# EAGLE design midipal-v03 (EAGLE 5.09)
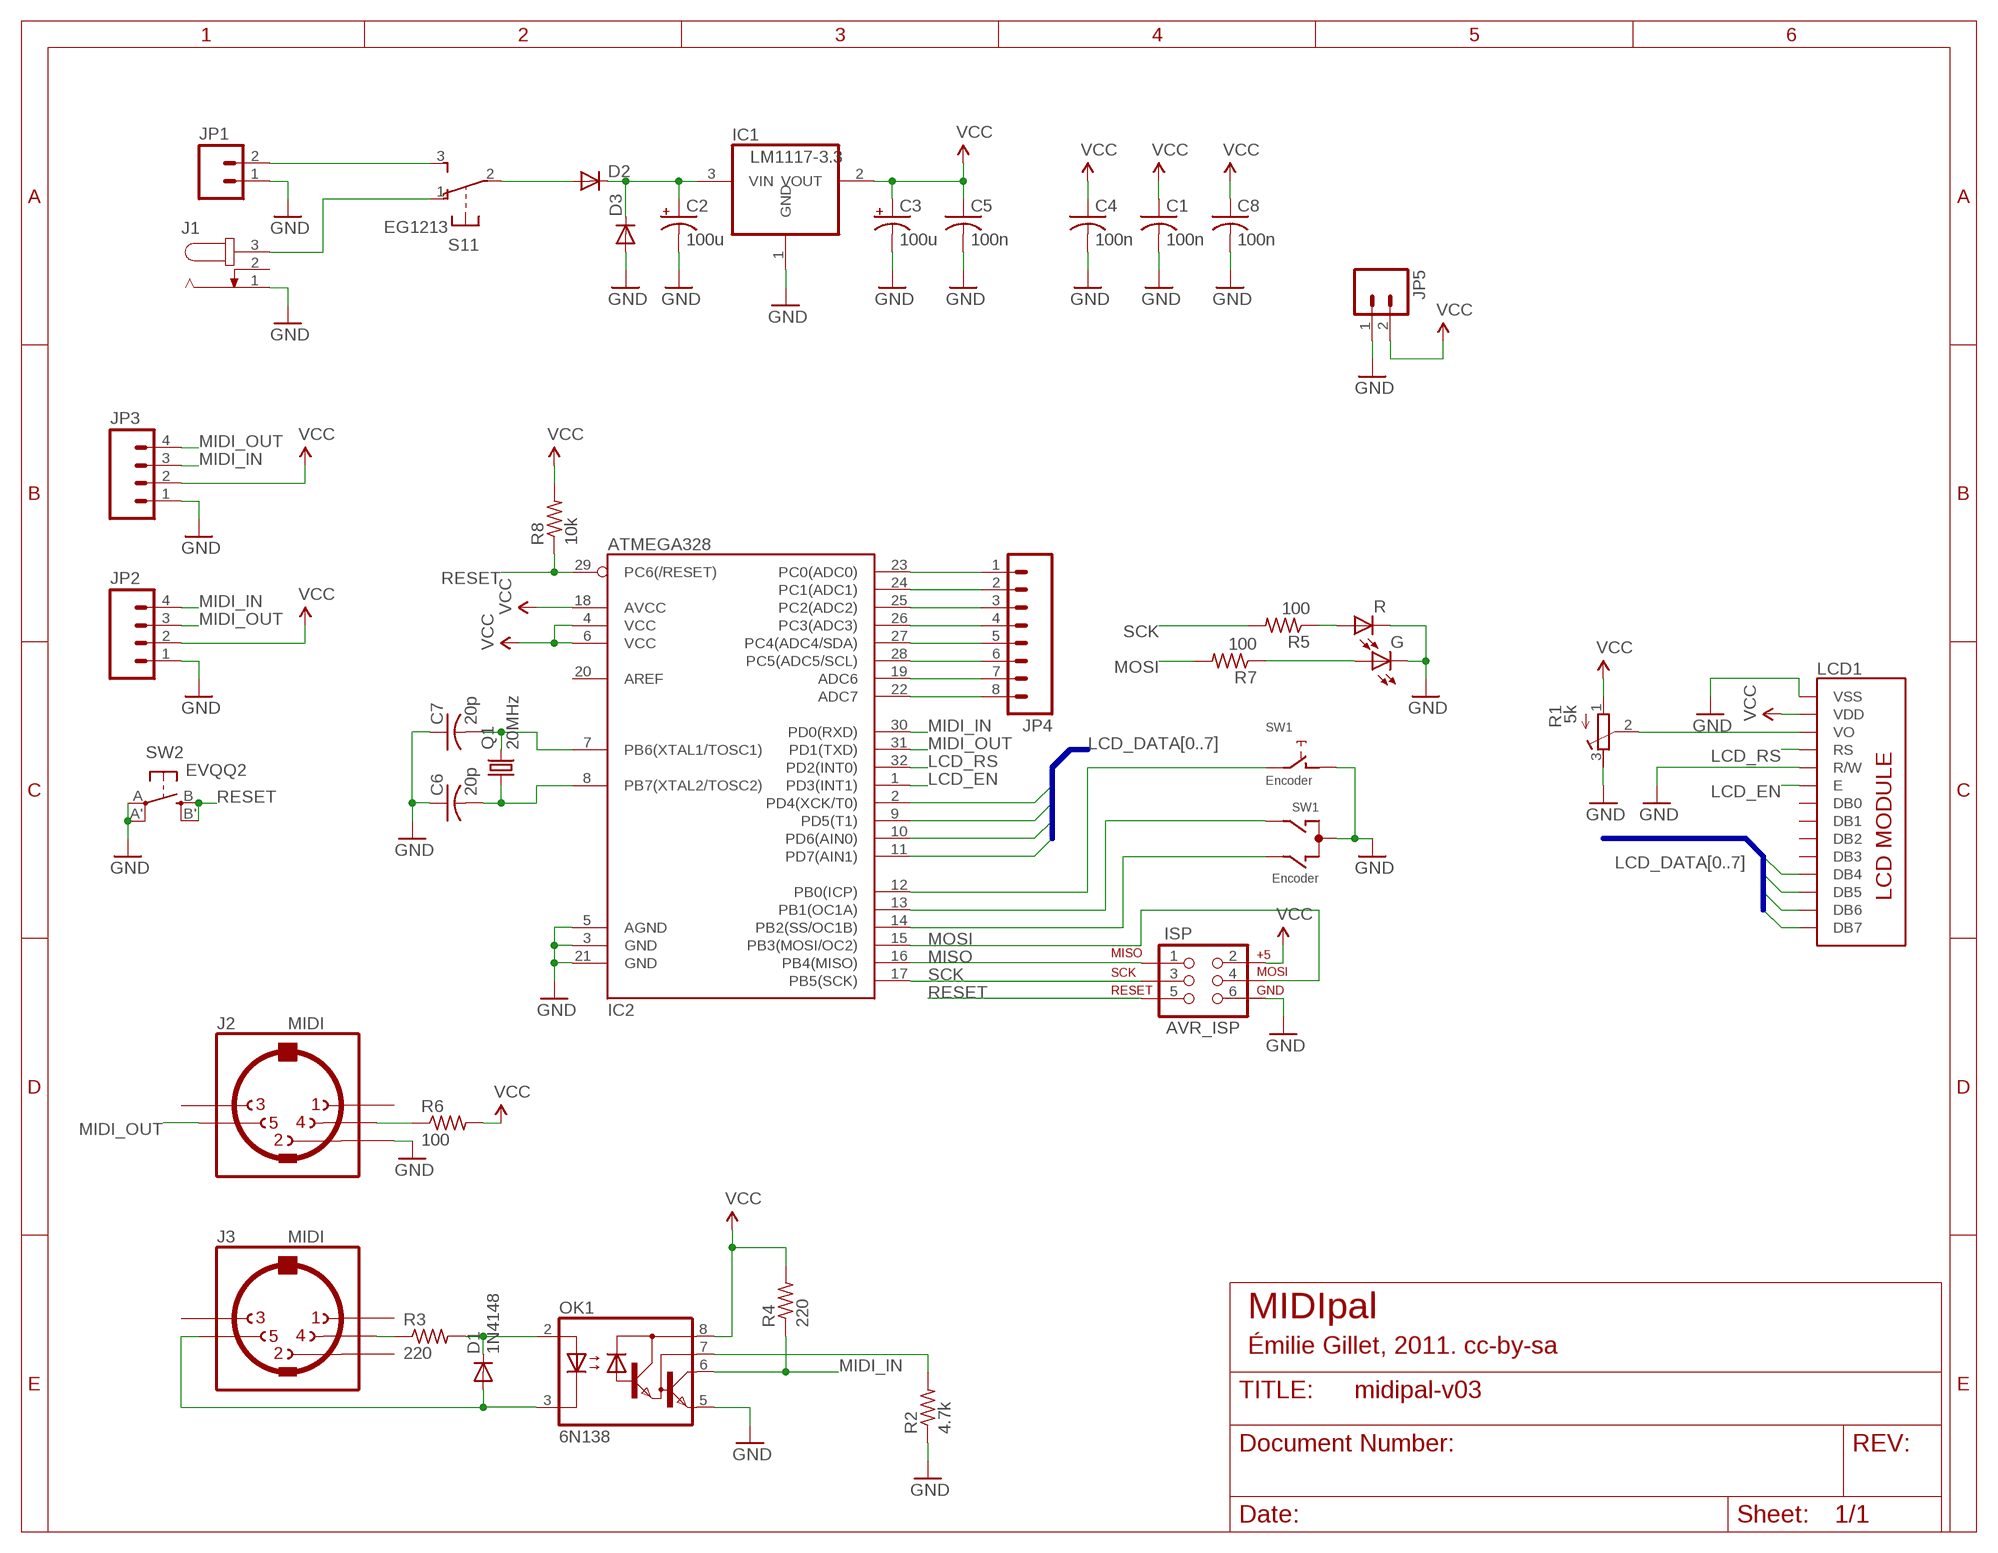
[diagram p0: schematic, sheet 1]

## Parts
C1  100n  C-USC0805  [C0805]
C2  100u  CPOL-USD  [PANASONIC_D]
C3  100u  CPOL-USD  [PANASONIC_D]
C4  100n  C-USC0805  [C0805]
C5  100n  C-USC0805  [C0805]
C6  20p  C-USC0805  [C0805]
C7  20p  C-USC0805  [C0805]
C8  100n  C-USC0805  [C0805]
D1  1N4148  DIODE-SOD323-W  [SOD323-W]
D2  DIODESMB  [SMB-DIODE]
D3  DIODESMB  [SMB-DIODE]
G  LEDCHIPLED_1206  [CHIPLED_1206]
IC1  LM1117-3.3  REG1117  [SOT223]
IC2  ATMEGA328  ATMEGA168  [TQFP32-08]
ISP  AVR_ISP  AVR_SPI_PRG_6PTH  [2X3]
J1  JACK-PLUG2  [SPC4078_BIG_HOLES]
J2  MIDI  MAB5SH  [MAB5SH]
J3  MIDI  MAB5SH  [MAB5SH]
JP1  M02  [1X02_LONGPADS]
JP2  M04PTH  [1X04]
JP3  M04PTH  [1X04]
JP4  M08  [1X08]
JP5  M02PTH  [1X02]
LCD1  LCD_MODULE_NO_BKL  [LCD_MODULE_1X8]
OK1  6N138  6N138SMD8  [DIL8-SMD]
Q1  20MHz  CRYSTALHC49UP  [HC49UP]
R  LEDCHIPLED_1206  [CHIPLED_1206]
R1  5k  R-TRIMM3296P  [RTRIM3296P]
R2  4.7k  R-US_M0805  [M0805]
R3  220  R-US_M0805  [M0805]
R4  220  R-US_R0805  [R0805]
R5  100  R-US_R0805  [R0805]
R6  100  R-US_R0805  [R0805]
R7  100  R-US_R0805  [R0805]
R8  10k  R-US_R0805  [R0805]
S1  EG1213  [EG1213]
SW1  Encoder  EC12E_SW  [ALPS_EC12E_SW]
SW2  EVQQ2  [EVQ-Q2]

## Nets
GND: C1.2 C2.- C3.- C4.2 C5.2 C6.1 C7.1 C8.2 D3.A G.C IC1.1(GND) IC2.3(GND) IC2.5(AGND) IC2.21(GND) ISP.6 J1.1 J2.2 JP1.1 JP2.1 JP3.1 JP5.1 LCD1.1(VSS) LCD1.5(R/W) OK1.5(GND) R1.3(A) R2.1 R.C SW1.C SW1.D SW2.A'(P1) SW2.A(P)
LCD_DATA4: IC2.2(PD4(XCK/T0)) LCD1.11(DB4)
LCD_DATA5: IC2.9(PD5(T1)) LCD1.12(DB5)
LCD_DATA6: IC2.10(PD6(AIN0)) LCD1.13(DB6)
LCD_DATA7: IC2.11(PD7(AIN1)) LCD1.14(DB7)
LCD_EN: IC2.1(PD3(INT1)) LCD1.6(E)
LCD_RS: IC2.32(PD2(INT0)) LCD1.4(RS)
MIDI_IN: IC2.30(PD0(RXD)) JP2.4 JP3.3 OK1.6(VO) R4.1
MIDI_OUT: IC2.31(PD1(TXD)) J2.5 JP2.3 JP3.4
MISO: IC2.16(PB4(MISO)) ISP.1
MOSI: IC2.15(PB3(MOSI/OC2)) ISP.4 R7.2
N$1: J1.3 S1.1(1:O)
N$2: C2.+ D2.C D3.C IC1.3(VIN)
N$3: IC2.23(PC0(ADC0)) JP4.1
N$4: D2.A S1.2(1:P)
N$5: IC2.24(PC1(ADC1)) JP4.2
N$6: IC2.25(PC2(ADC2)) JP4.3
N$7: IC2.26(PC3(ADC3)) JP4.4
N$8: IC2.27(PC4(ADC4/SDA)) JP4.5
N$9: IC2.28(PC5(ADC5/SCL)) JP4.6
N$10: IC2.19(ADC6) JP4.7
N$11: IC2.22(ADC7) JP4.8
N$12: G.A R7.1
N$13: OK1.7(VB) R2.2
N$14: R5.1 R.A
N$15: IC2.14(PB2(SS/OC1B)) SW1.B
N$16: IC2.13(PB1(OC1A)) SW1.A
N$17: IC2.12(PB0(ICP)) SW1.E
N$18: LCD1.3(VO) R1.2(S)
N$28: D1.C OK1.2(A) R3.2
N$68: J2.4 R6.1
N$72: J3.4 R3.1
N$73: D1.A J3.5 OK1.3(C)
N$82: C6.2 IC2.8(PB7(XTAL2/TOSC2)) Q1.1
N$83: C7.2 IC2.7(PB6(XTAL1/TOSC1)) Q1.2
RESET: IC2.29(PC6(/RESET)) ISP.5 R8.1 SW2.B'(S1) SW2.B(S)
SCK: IC2.17(PB5(SCK)) ISP.3 R5.2
VCC: C1.1 C3.+ C4.1 C5.1 C8.1 IC1.2(VOUT) IC2.4(VCC) IC2.6(VCC) IC2.18(AVCC) ISP.2 JP2.2 JP3.2 JP5.2 LCD1.2(VDD) OK1.8(VCC) R1.1(E) R4.2 R6.2 R8.2
VIN: JP1.2 S1.3(1:S)
Unconnected: IC2.20(AREF) J1.2 J2.1 J2.3 J3.1 J3.2 J3.3 LCD1.7(DB0) LCD1.8(DB1) LCD1.9(DB2) LCD1.10(DB3) S1.MT1(MT) S1.MT2(MT) SW1.GND1(G) SW1.GND2(G)

## Buses
LCD_DATA[0..7]

## Notes on the sheet
- MIDIpal
- Émilie Gillet, 2011. cc-by-sa

## Library data of the parts
C1 C4-C8 = rcl:C-US: CAPACITOR, American symbol
C2 C3 = rcl:CPOL-US: POLARIZED CAPACITOR, American symbol
D1 = diode:DIODE-: DIODE
D2 D3 = SparkFun:DIODE: Diode These are standard reverse protection diodes and small signal diodes. SMA package can handle up to about 1A. SOD-323 can handle about 200mA. What the SOD-323 package when ordering, there are some mfgs out there that are 5-pin packages.
G R = led:LED: LED OSRAM: - CHIPLED LG R971, LG N971, LY N971, LG Q971, LY Q971, LO R971, LY R971 LH N974, LH R974 LS Q976, LO Q976, LY Q976 LO Q996 - Hyper CHIPLED LW Q18S LB Q993, LB Q99A, LB R99A - SideLED LS A670, LO A670, LY A670, LG A670, LP A670 LB A673, LV A673, LT A673, LW A673 LH A674 LY A675 LS A676, LA A676, LO A676, LY A676, LW A676 LS A679, LY A679, LG A679 - Hyper Micro SIDELED® LS Y876, LA Y876, LO Y876, LY Y876 LT Y87S - SmartLED LW L88C, LW L88S LB L89C, LB L89S, LG L890 LS L89K, LO L89K, LY L89K LS L896, LA L896, LO L896, LY L896 - TOPLED LS T670, LO T670, LY T670, LG T670, LP T670 LSG T670, LSP T670, LSY T670, LOP T670, LYG T670 LG T671, LOG T671, LSG T671 LB T673, LV T673, LT T673, LW T673 LH T674 LS T676, LA T676, LO T676, LY T676, LB T676, LH T676, LSB T676, LW T676 LB T67C, LV T67C, LT T67C, LS T67K, LO T67K, LY T67K, LW E67C LS E67B, LA E67B, LO E67B, LY E67B, LB E67C, LV E67C, LT E67C LW T67C LS T679, LY T679, LG T679 LS T770, LO T770, LY T770, LG T770, LP T770 LB T773, LV T773, LT T773, LW T773 LH T774 LS E675, LA E675, LY E675, LS T675 LS T776, LA T776, LO T776, LY T776, LB T776 LHGB T686 LT T68C, LB T68C - Hyper Mini TOPLED® LB M676 - Mini TOPLED Santana® LG M470 LS M47K, LO M47K, LY M47K Source: http://www.osram.convergy.de LUXEON: - LUMILED® LXK2-PW12-R00, LXK2-PW12-S00, LXK2-PW14-U00, LXK2-PW14-V00 LXK2-PM12-R00, LXK2-PM12-S00, LXK2-PM14-U00 LXK2-PE12-Q00, LXK2-PE12-R00, LXK2-PE12-S00, LXK2-PE14-T00, LXK2-PE14-U00 LXK2-PB12-K00, LXK2-PB12-L00, LXK2-PB12-M00, LXK2-PB14-N00, LXK2-PB14-P00, LXK2-PB14-Q00 LXK2-PR12-L00, LXK2-PR12-M00, LXK2-PR14-Q00, LXK2-PR14-R00 LXK2-PD12-Q00, LXK2-PD12-R00, LXK2-PD12-S00 LXK2-PH12-R00, LXK2-PH12-S00 LXK2-PL12-P00, LXK2-PL12-Q00, LXK2-PL12-R00 Source: www.luxeon.com KINGBRIGHT: KA-3528ASYC Source: www.kingbright.com
IC1 = burr-brown:REG1117: 800mA and 1A Low Dropout (LDO) Positive Regulator 1.8V, 2.5V, 2.85V, 3.3V, 5V, and Adj
IC2 = SparkFun:ATMEGA168
ISP = SparkFun:AVR_SPI_PRG_6: AVR ISP 6 Pin This is the reduced ISP connector for AVR programming. Common on Arduino. This footprint will take up less PCB space and can be used with a 10-pin to 6-pin adapter such as SKU: BOB-08508
J1 = con-jack2:JACK-PLUG: DC POWER JACK Power Jack, DC, Right Angle, Through Hole, Rated 5A at 16VDC, PC Terminals Distributor: Farnell (www.Farnell.de) Drawing: 84N1161.pdf / 84N1162.pdf Manufacturer: SPC Technology (www.spctechnology.com) Type: SPC4077 / SPC 4078
J2 J3 = og-midi:MAB5SH: Female CONNECTOR 5 pins 90 deg. with shield, horizontal (DIN 41524)
JP1 JP5 = SparkFun:M02: Header 2 Standard 2-pin 0.1" header. Use with straight break away headers (SKU : PRT-00116), right angle break away headers (PRT-00553), swiss pins (PRT-00743), machine pins (PRT-00117), and female headers (PRT-00115). Molex polarized connector foot print use with SKU : PRT-08233 with associated crimp pins and housings.
JP2 JP3 = SparkFun:M04: Header 4 Standard 4-pin 0.1" header. Use with straight break away headers (SKU : PRT-00116), right angle break away headers (PRT-00553), swiss pins (PRT-00743), machine pins (PRT-00117), and female headers (PRT-00115). Molex polarized connector foot print use with SKU : PRT-08231 with associated crimp pins and housings.
JP4 = SparkFun:M08: Header 8 Standard 8-pin 0.1" header. Use with straight break away headers (SKU : PRT-00116), right angle break away headers (PRT-00553), swiss pins (PRT-00743), machine pins (PRT-00117), and female headers (PRT-00115).
LCD1 = og-lcd:LCD_MODULE_NO_BKL
OK1 = og-optocouplers:6N138: MOTOROLA OPTO COUPLER
Q1 = crystal:CRYSTAL: CRYSTAL
R1 = rcl:R-TRIMM: Trimm resistor
R2-R8 = rcl:R-US_: RESISTOR, American symbol
S1 = adafruit:EG1213: E-Switch right-angle slide SPDT Part #EG1213 http://www.ladyada.net/library/eagle
SW1 = switch-alps:EC12E_SW: ALPS rotary Encoder EC12E series with switch
SW2 = adafruit:EVQQ2: SMT 6mm switch, EVQQ2 series http://www.ladyada.net/library/eagle

## Board
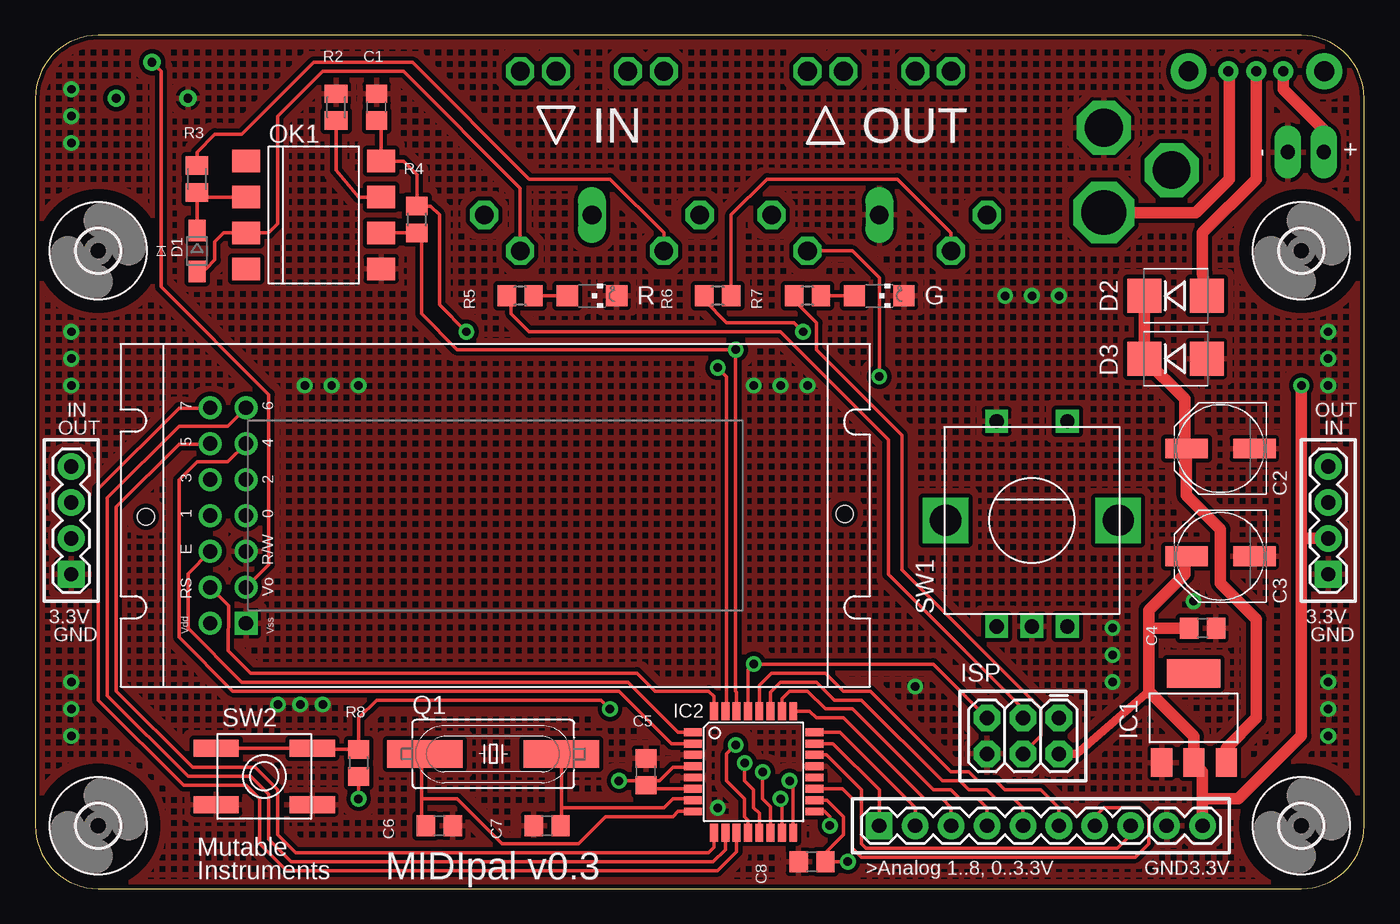
[diagram p1: board, top side]
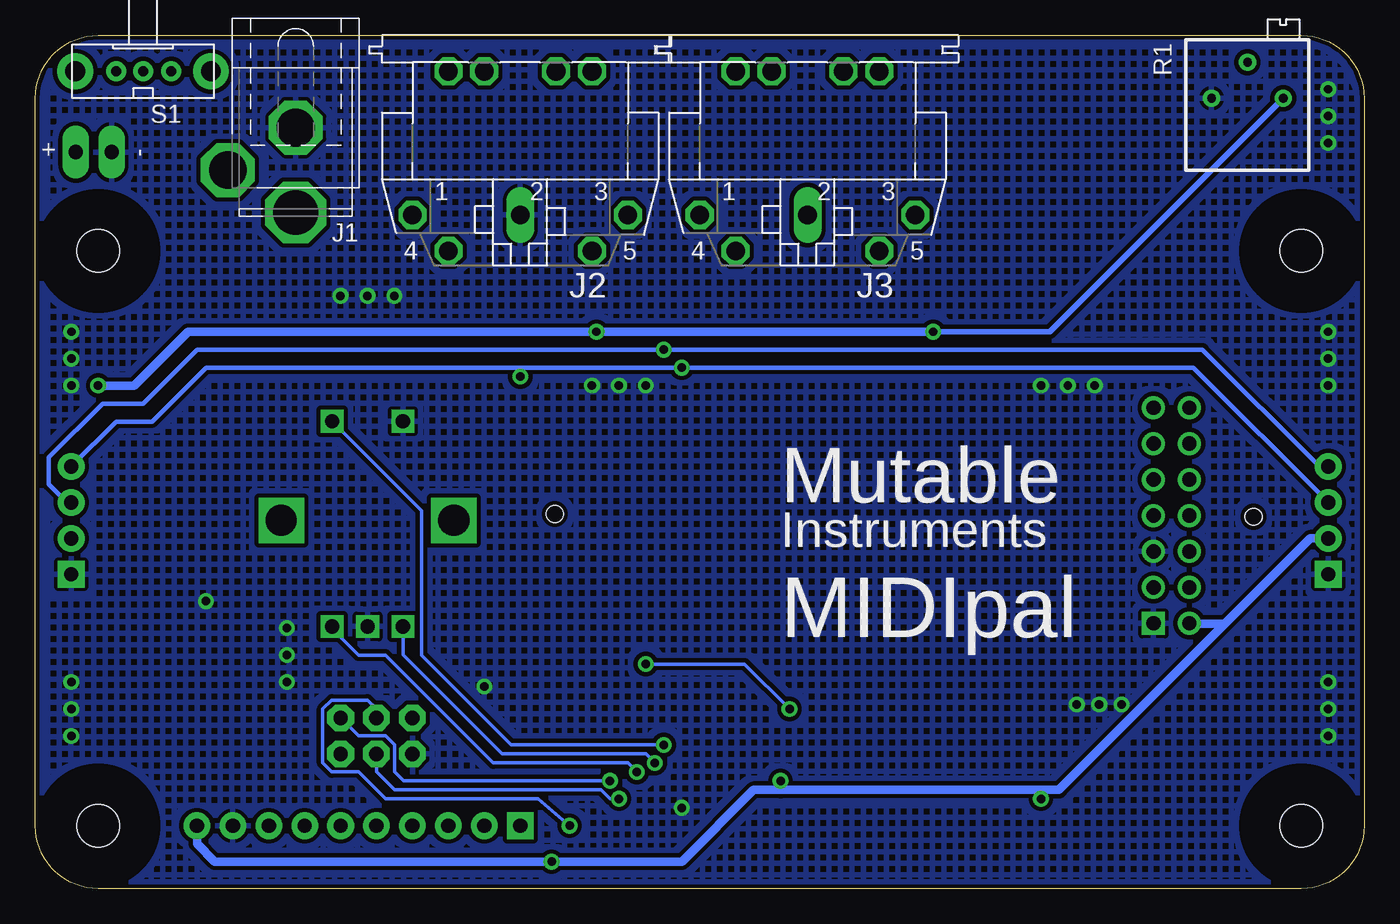
[diagram p2: board, bottom side, seen from below]

Size 93.98 x 60.33 mm. Coordinates in mm from the lower left corner, seen from the top.
Outline: 4.45,60.33 arc90 0,55.88 0,4.45 arc90 4.45,0 89.53,0 arc90 93.98,4.45 93.98,55.88 arc90 89.53,60.33 4.45,60.33
Copper layers (1*16): Top 0.035mm / dielectric 1.5mm / Bottom 0.035mm
Design rules "SparkFun": minimum track width 8mil, minimum drill 20mil, track to track 8mil, track to pad 8mil, pad to pad 8mil, via to via 8mil, smd to smd 8mil, copper to edge 10mil, drill to drill 8mil, minimum pad ring 12mil, minimum via ring 10mil, stop-mask expansion 4mil, vias tented up to drill 25mil, thermal gap 10mil

### Footprints (pad centres in the part's own frame; a part is rotated, then mirrored left to right if it is on the bottom)
C0805 = smd 1.3 x 1.5: 1 -0.95,0; 2 0.95,0
PANASONIC_D = smd 3 x 1.4: + 2.4,0; - -2.4,0
SOD323-W = smd 1.5 x 1.2: A 1.45,0; C -1.45,0
SMB-DIODE = smd 2.4 x 2.4: A 2.2,0; C -2.2,0
CHIPLED_1206 = smd 1.5 x 1.5: A 0,-1.75; C 0,1.75
SOT223 = smd 1.499 x 2.007: 1 -2.261,-3.15; 2 0.025,-3.15; 3 2.311,-3.15 | smd 3.81 x 2.007: 4 0,3.15
TQFP32-08 = smd 1.27 x 0.559: 1 -4.293,2.8; 2 -4.293,2; 3 -4.293,1.2; 4 -4.293,0.4; 5 -4.293,-0.4; 6 -4.293,-1.2; 7 -4.293,-2; 8 -4.293,-2.8; 17 4.293,-2.8; 18 4.293,-2; 19 4.293,-1.2; 20 4.293,-0.4; 21 4.293,0.4; 22 4.293,1.2; 23 4.293,2; 24 4.293,2.8 | smd 0.559 x 1.27: 9 -2.8,-4.293; 10 -2,-4.293; 11 -1.2,-4.293; 12 -0.4,-4.293; 13 0.4,-4.293; 14 1.2,-4.293; 15 2,-4.293; 16 2.8,-4.293; 25 2.8,4.293; 26 2,4.293; 27 1.2,4.293; 28 0.4,4.293; 29 -0.4,4.293; 30 -1.2,4.293; 31 -2,4.293; 32 -2.8,4.293
2X3 = drill 1.016 pad 1.88 octagon: 1 0,0; 2 0,2.54; 3 2.54,0; 4 2.54,2.54; 5 5.08,0; 6 5.08,2.54
SPC4078_BIG_HOLES = drill 2.667 pad 3.81 octagon: 1 -0.46,0; 2 2.54,-4.8 | drill 3.175 pad 4.318 octagon: 3 5.54,0
MAB5SH = drill 1.321 octagon: 1 7.62,7.62; 3 -7.62,7.62; 4 5.08,10.16; 5 -5.08,10.16; P$1 -5.08,-2.54; P$2 -2.54,-2.54; P$3 2.54,-2.54; P$4 5.08,-2.54 | drill 1.321 long: 2 0,7.62
1X02_LONGPADS = drill 1.016 pad 1.88 long: 1 0,0; 2 2.54,0
1X04 = drill 1.016 pad 1.88 square: 1 0,0 | drill 1.016 pad 1.88 round: 2 2.54,0; 3 5.08,0; 4 7.62,0
1X08 = drill 1.016 pad 1.88 square: 1 0,0 | drill 1.016 pad 1.88 round: 2 2.54,0; 3 5.08,0; 4 7.62,0; 5 10.16,0; 6 12.7,0; 7 15.24,0; 8 17.78,0
1X02 = drill 1.016 pad 1.88 round: 1 0,0; 2 2.54,0
LCD_MODULE_1X8 = drill 1.016 square: 1 8.87,4.47 | drill 1.016 round: 2 6.33,4.47; 3 8.87,7.01; 4 6.33,7.01; 5 8.87,9.55; 6 6.33,9.55; 7 8.87,12.09; 8 6.33,12.09; 9 8.87,14.63; 10 6.33,14.63; 11 8.87,17.17; 12 6.33,17.17; 13 8.87,19.71; 14 6.33,19.71 | hole 1.2: 1.8,12; 51.2,12.2
DIL8-SMD = smd 1.6 x 2: 1 -3.81,-4.77; 2 -1.27,-4.77; 3 1.27,-4.77; 4 3.81,-4.77; 5 3.81,4.77; 6 1.27,4.77; 7 -1.27,4.77; 8 -3.81,4.77
HC49UP = smd 5.334 x 1.93: 1 -4.826,0; 2 4.826,0
RTRIM3296P = drill 0.61 round: 1 0,-2.54; 2 2.54,0; 3 0,2.54
M0805 = smd 1.3 x 1.6: 1 -0.95,0; 2 0.95,0
R0805 = smd 1.3 x 1.5: 1 -0.95,0; 2 0.95,0
EG1213 = drill 0.7 pad 1.422 round: 1 -2,0; 2 0,0; 3 1.9,0 | drill 1.4 pad 2.54 round: MT1 -4.8,0; MT2 4.8,0
ALPS_EC12E_SW = drill 1 square: A -2.5,-7.5; B 2.5,-7.5; C 0,-7.5; D -2.5,7; E 2.5,7 | drill 2.2 square: GND1 -6.1,0; GND2 6.1,0
EVQ-Q2 = smd 3.2 x 1.2: A -3.4,-2; A' 3.4,-2; B -3.4,2; B' 3.4,2
3,0 = hole 3: 0,0

### Placement (x,y rotation side)
C1  24.13,55.25 90 top
C2  83.82,31.11 180 top
C3  83.82,23.49 180 top
C4  82.55,18.41 0 top
C5  43.18,8.26 90 top
C6  28.57,4.45 180 top
C7  36.2,4.45 0 top
C8  54.93,1.91 180 top
D1  11.43,45.09 270 top
D2  80.64,41.91 0 top
D3  80.64,37.47 0 top
G  59.69,41.91 270 top
IC1  81.91,12.06 0 top
IC2  50.8,8.26 0 top
ISP  72.39,12.06 180 top
J1  75.56,53.34 270 bottom
J2  59.69,55.25 180 bottom
J3  39.37,55.25 180 bottom
JP1  88.58,52.07 0 top
JP2  2.54,22.22 90 top
JP3  91.44,22.22 90 top
JP4  59.69,4.45 0 top
JP5  80.01,4.45 0 top
LCD1  6.03,14.29 0 top
OK1  19.68,47.62 270 top
Q1  32.38,9.53 0 top
R  39.37,41.91 270 top
R1  8.26,55.88 90 bottom
R2  21.27,55.25 270 top
R3  11.43,50.16 270 top
R4  26.99,47.31 90 top
R5  34.29,41.91 180 top
R6  48.26,41.91 180 top
R7  54.61,41.91 180 top
R8  22.86,8.89 270 top
S1  86.36,57.79 180 bottom
SW1  70.48,26.04 0 top
SW2  16.19,7.94 0 top
U$1  [3,0]  4.45,45.09 0 top
U$2  [3,0]  89.53,45.09 0 top
U$3  [SARASWATI]  57.15,17.78 0 bottom
U$4  [3,0]  4.45,4.45 0 top
U$5  [3,0]  89.53,4.45 0 top

### Tracks (layer width: path | path; a pad name or v marks a point on that pad's centre or on a via)
GND  (via drill 0.6)
  other vias: 81.91,20.32 48.26,5.71 62.23,14.29 76.2,18.41 76.2,16.51 76.2,14.61 17.14,13.02 18.73,13.02 20.32,13.02 50.8,35.56 2.54,56.52 2.54,54.61 2.54,52.71 2.54,39.37 2.54,37.47 68.58,41.91 70.48,41.91 72.39,41.91 22.86,35.56 20.95,35.56 19.05,35.56 52.71,35.56 54.61,35.56 2.54,35.56 2.54,14.61 2.54,12.7 2.54,10.79 91.44,14.61 91.44,12.7 91.44,10.79 91.44,35.56 91.44,37.47 91.44,39.37
  pour Top (isolate 0.305, hatched): -1.27,61.59 -1.27,-0.64 95.25,-0.64 95.25,61.59
  pour Bottom (isolate 0.305, hatched): -1.27,-0.64 95.25,-0.64 95.25,61.59 -1.27,61.59
LCD_DATA4
  Top 0.254: LCD1.11 13.61,30.16 11.43,30.16 10.16,28.89 10.16,17.78 13.97,13.97 41.28,13.97 44.99,10.26 IC2.2
LCD_DATA5
  Top 0.254: LCD1.12 12.34,31.43 10.16,31.43 5.71,26.99 5.71,13.97 11.11,8.57 15.56,8.57 17.14,6.99 17.14,3.81 18.41,2.54 47.62,2.54 48,2.92 IC2.9
LCD_DATA6
  Top 0.254: LCD1.13 13.61,32.7 10.16,32.7 5.08,27.62 5.08,13.65 10.79,7.94 15.24,7.94 16.51,6.67 16.51,3.49 18.1,1.91 47.94,1.91 48.8,2.76 IC2.10
LCD_DATA7
  Top 0.254: LCD1.14 11.7,33.97 10.16,33.97 4.45,28.26 4.45,13.34 10.48,7.3 14.92,7.3 15.88,6.35 15.88,3.17 17.78,1.27 48.26,1.27 49.6,2.61 IC2.11
LCD_EN
  Top 0.254: LCD1.6 10.79,22.27 10.79,18.41 14.61,14.61 41.91,14.61 45.46,11.05 IC2.1
LCD_RS
  Top 0.254: LCD1.4 13.66,20 13.65,16.83 15.24,15.24 42.55,15.24 43.82,13.97 47.62,13.97 48,13.6 IC2.32
MIDI_IN  (via drill 0.6)
  Top 0.254: OK1.6 26.67,46.36 | R4.1 26.67,46.36 | IC2.30 49.6,13.9 49.53,13.97 v49.53,38.1 29.84,38.1 27.3,40.64 27.3,45.72 26.67,46.36
  Bottom 0.305: JP2.4 3.17,29.84 11.43,38.1 v49.53,38.1 82.55,38.1 86.36,34.29 89.22,34.29 93.03,30.48 93.03,28.57 91.76,27.3 JP3.3
MIDI_OUT  (via drill 0.6)
  Top 0.254: IC2.31 48.9,12.64 48.9,36.2 v48.26,36.83 | J2.5 57.79,45.09 59.69,43.18 v59.69,36.2
  Bottom 0.254: 59.69,36.83 v59.69,36.2
  Bottom 0.305: JP2.3 12.06,36.83 v48.26,36.83 59.69,36.83 81.91,36.83 85.72,33.02 88.27,33.02 JP3.4
MISO  (via drill 0.6)
  Top 0.254: v53.34,7.62 53.6,7.36 IC2.16
  Bottom 0.254: ISP.1 71.12,10.79 69.21,10.79 68.58,10.16 68.58,8.26 67.94,7.62 v53.34,7.62
MOSI  (via drill 0.6)
  Top 0.254: ISP.4 71.12,10.79 71.12,12.7 61.28,22.54 61.28,32.07 55.25,38.1 55.25,40.01 53.98,41.27 R7.2 | v52.71,6.35 52.8,6.25 IC2.15
  Bottom 0.254: ISP.4 69.85,8.26 68.58,6.99 53.98,6.99 53.34,6.35 v52.71,6.35
N$1
  Top 0.813: S1.1 84.45,57.05 84.45,50.16 82.09,47.8 J1.3
N$2
  Top 0.813: IC1.3 84.23,9.93 86.36,12.06 86.36,19.05 83.82,21.59 83.82,25.4 81.42,27.8 C2.+ 81.28,29.35 81.28,34.63 D3.C D2.C
N$3
  Top 0.254: JP4.1 59.69,6.99 56.42,10.26 IC2.23
N$4
  Top 0.813: D2.A 82.55,43.52 82.55,46.36 86.36,50.16 S1.2
N$5
  Top 0.254: JP4.2 62.23,5.71 56.89,11.05 IC2.24
N$6
  Top 0.254: JP4.3 64.77,5.71 64.14,6.35 62.87,6.35 57.15,12.06 55.25,12.06 54.76,12.55 IC2.25
N$7
  Top 0.254: JP4.4 67.31,5.71 66.67,6.35 65.41,6.35 64.77,6.99 63.5,6.99 57.79,12.7 55.88,12.7 54.61,13.97 53.34,13.97 52.8,13.43 IC2.26
N$8
  Top 0.254: JP4.5 69.85,5.71 69.21,6.35 67.94,6.35 67.31,6.99 66.04,6.99 65.41,7.62 64.14,7.62 58.42,13.34 56.52,13.34 55.25,14.61 52.71,14.61 52,13.9 IC2.27
N$9
  Top 0.254: JP4.6 72.39,5.71 71.12,6.99 68.58,6.99 67.94,7.62 66.67,7.62 66.04,8.26 64.77,8.26 59.05,13.97 57.15,13.97 55.88,15.24 52.07,15.24 51.2,14.37 IC2.28
N$10
  Top 0.254: JP4.7 74.93,5.08 75.56,5.71 78.1,5.71 78.74,5.08 78.74,3.17 77.79,2.22 58.42,2.22 57.79,2.86 57.79,6.35 57.08,7.06 IC2.19
N$11
  Top 0.254: JP4.8 77.47,3.81 76.52,2.86 58.74,2.86 58.42,3.17 58.42,6.99 55.95,9.46 IC2.22
N$12
  Top 0.254: R7.1 G.A
N$13
  Top 0.254: R2.2 21.27,50.8 22.86,48.9 OK1.7
N$14
  Top 0.254: R5.1 R.A
N$15  (via drill 0.6)
  Top 0.254: v51.44,8.26 51.44,6.35 52,5.79 IC2.14
  Bottom 0.254: v51.44,8.26 52.07,8.89 61.6,8.89 69.21,16.51 71.12,16.51 72.98,18.38 SW1.B
N$16  (via drill 0.6)
  Top 0.254: v50.17,8.89 50.17,7.62 50.8,6.99 50.8,5.71 51.2,5.32 IC2.13
  Bottom 0.254: v50.17,8.89 50.8,9.53 60.96,9.53 67.98,16.55 SW1.A
N$17  (via drill 0.6)
  Top 0.254: v49.53,10.16 48.9,9.53 48.9,7.62 50.17,6.35 50.17,5.08 50.4,4.85 IC2.12
  Bottom 0.254: SW1.E 66.67,26.72 66.67,16.51 60.33,10.16 v49.53,10.16
N$18
  Top 0.254: LCD1.3 16.51,22.9 16.51,34.93 8.89,42.55 8.89,57.79 R1.2
N$28
  Top 0.254: D1.C R3.2 11.74,49.22 12.06,48.9 OK1.2
N$68
  Top 0.254: R6.1 49.21,42.55 49.21,47.62 51.75,50.16 60.96,50.16 64.77,46.36 J2.4
N$72
  Top 0.254: J3.4 44.45,46.36 40.64,50.16 34.93,50.16 26.67,58.42 19.68,58.42 14.61,53.34 12.7,53.34 11.43,52.07 R3.1
N$73
  Top 0.254: OK1.3 14.73,46.18 | J3.5 34.29,49.53 26.04,57.79 20.32,57.79 17.14,54.61 17.14,46.99 16.51,46.36 OK1.3 | D1.A 11.61,43.82 12.06,43.82 12.7,44.45 12.7,45.72 13.33,46.36 OK1.3
N$82
  Top 0.254: Q1.1 27.62,9.46 27.3,9.14 27.3,6.35 | 27.3,6.35 29.84,6.35 33.02,3.17 38.42,3.17 40.32,5.08 45.09,5.08 45.46,5.46 IC2.8 | 27.3,6.35 27.3,5.08 27.62,4.76 C6.2
N$83
  Top 0.254: C7.2 37.21,4.51 37.21,5.71 | 37.21,5.71 Q1.2 | IC2.7 46.41,6.35 45.09,6.35 44.45,5.71 37.21,5.71
RESET  (via drill 0.6)
  Top 0.254: SW2.B SW2.B' 18.42,9.84 R8.1 22.86,12.06 24.13,13.34 40.01,13.34 v40.64,12.7 | ISP.5 63.5,15.88 v50.8,15.88 50.4,15.47 IC2.29
  Bottom 0.254: v40.64,12.7 43.82,15.88 v50.8,15.88
SCK  (via drill 0.6)
  Top 0.254: R5.2 33.66,42.23 33.66,40.64 34.93,39.37 52.71,39.37 60.33,31.75 60.33,22.22 69.85,12.7 ISP.3 | v56.2,4.45 56.2,5.08 55.82,5.46 IC2.17
  Bottom 0.254: ISP.3 69.85,12.7 70.48,13.34 73.02,13.34 73.66,12.7 73.66,8.89 73.02,8.26 71.12,8.26 69.21,6.35 58.42,6.35 v56.2,4.45
VCC  (via drill 0.6)
  Top 0.254: C1.1 24.45,54.3 OK1.8 26.04,51.44 26.99,50.48 R4.2 27.94,48.26 28.57,47.62 28.57,41.27 v30.48,39.37 | 47.62,42.23 R6.2 47.31,41.59 48.9,40.01 53.66,40.01 v54.29,39.37 | C5.1 43.43,7.06 IC2.6 | IC2.4 46.43,8.57 45.09,8.57 44.13,7.62 43.5,7.62 C5.1 | C5.1 42.87,7.62 v41.28,7.62 | v22.86,6.35 R8.2 | IC2.18 55.98,6.25 57.15,5.08 57.15,3.81 55.88,2.54 C8.1 v57.47,1.91
  Top 0.61: 78.74,13.97 73.66,9.53 ISP.2
  Top 0.813: 78.74,18.41 78.74,13.97 81.94,10.77 IC1.2 82.55,8.26 82.55,6.35 | 78.74,18.41 78.74,19.68 81.28,22.22 81.28,22.72 C3.+ | 78.74,18.41 C4.1 | 89.53,24.76 v89.53,35.56 | 89.53,24.76 JP3.2 | JP5.2 82.55,6.35 | 89.53,24.76 89.53,10.79 85.09,6.35 82.55,6.35
  Bottom 0.254: 41.28,6.99 v41.28,7.62
  Bottom 0.406: v30.48,39.37 22.22,39.37 R1.1
  Bottom 0.61: v30.48,39.37 v54.29,39.37 83.19,39.37 86.99,35.56 v89.53,35.56 | JP5.2 82.55,3.17 81.28,1.91 v57.47,1.91 48.26,1.91 43.18,6.99 41.28,6.99 22.86,6.99 | 22.86,6.99 21.59,6.99 9.84,18.73 | 22.86,6.99 v22.86,6.35 | JP2.2 3.81,24.76 9.84,18.73 | LCD1.2 12.34,18.73 9.84,18.73
VIN
  Top 0.813: S1.3 88.27,56.52 91.12,53.65 JP1.2

### Text on the board
tNames: IN | OUT | - | + | IN | OUT | OUT | IN | 3.3V | 3.3V | GND | GND | Mutable | >Analog 1..8, 0..3.3V | GND | 3.3V | Instruments | MIDIpal v0.3
bNames: - | + | Mutable | Instruments | MIDIpal